# EAGLE design LEDDistortionV2 (EAGLE 6.5.0)
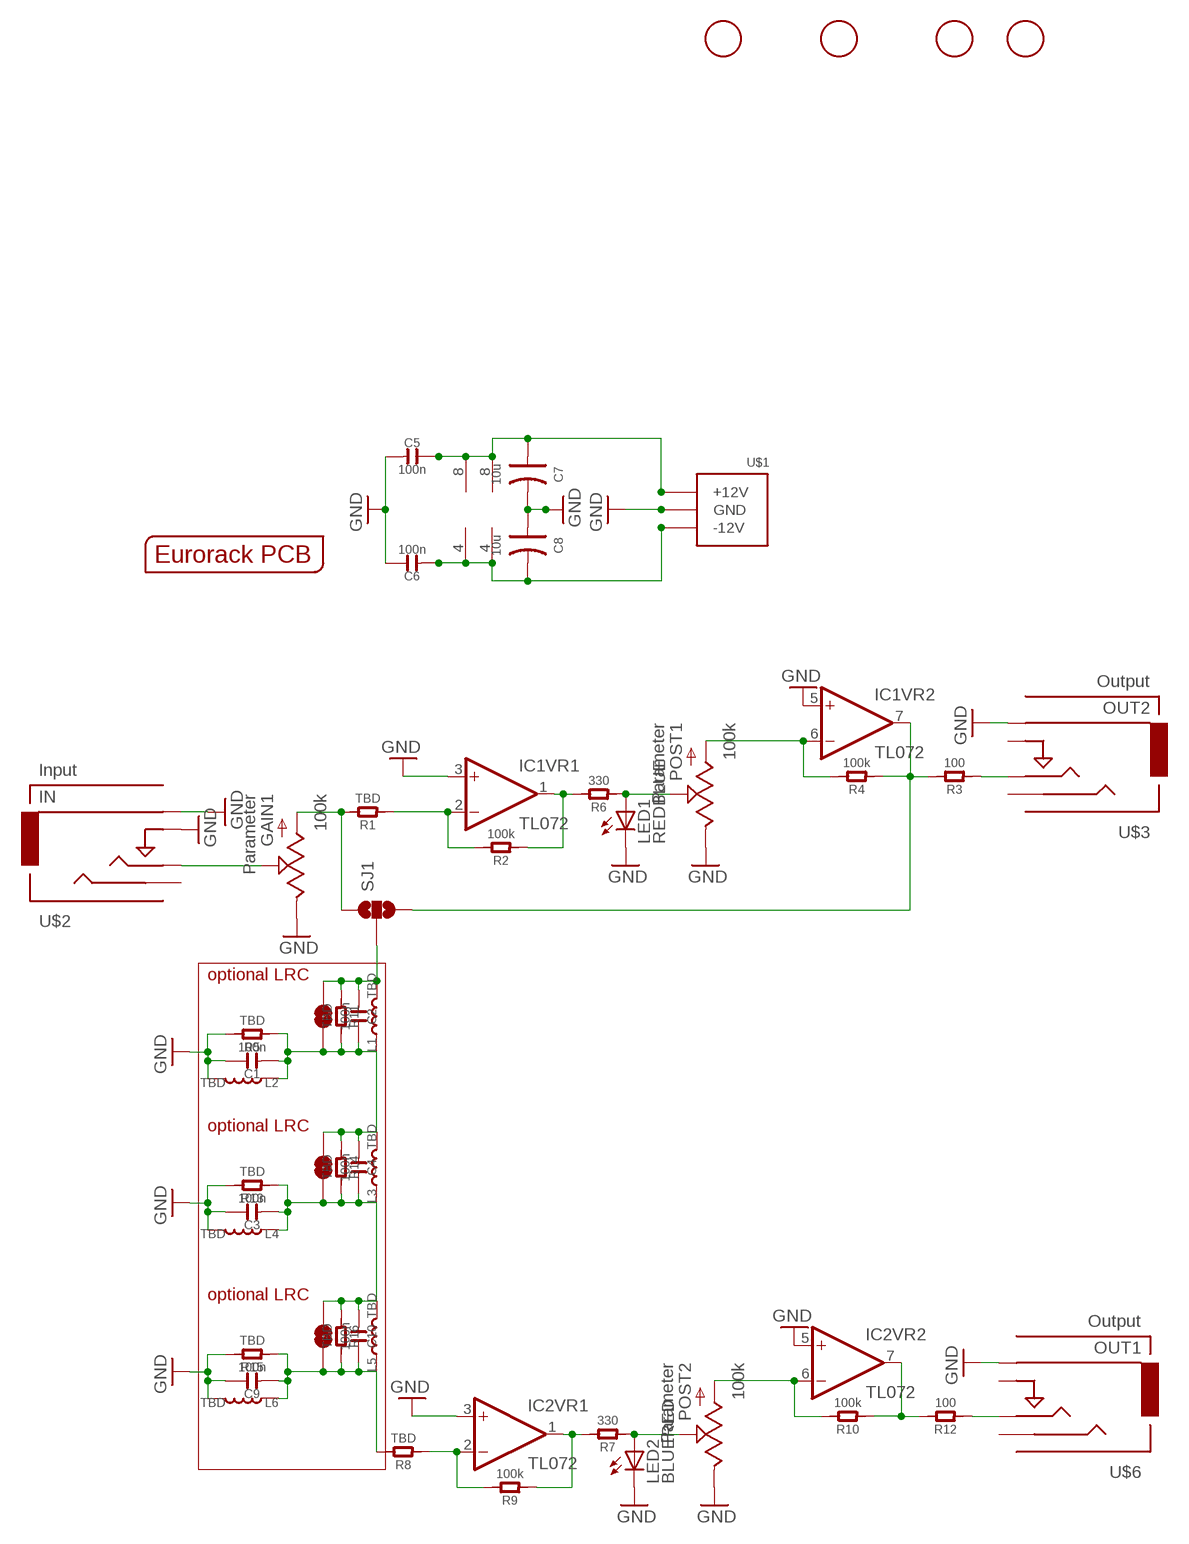
[diagram p0: schematic, sheet 1]

## Parts
C1  100n  C-0805  [C0805]
C2  100n  C-0805  [C0805]
C3  100n  C-0805  [C0805]
C4  100n  C-0805  [C0805]
C5  100n  C-0805  [C0805]
C6  100n  C-0805  [C0805]
C7  10u  C-POLAR-A  [AVX-A]
C8  10u  C-POLAR-A  [AVX-A]
C9  100n  C-0805  [C0805]
C10  100n  C-0805  [C0805]
GAIN1  100k  POTZEPHPOT  [OG-POTS_ALPS_POT_VERTICAL]
IC1  TL072  [SO08]
IC2  TL072  [SO08]
L1  TBD  L-SPD3D16-4R7M  [L0420]
L2  TBD  L-SPD3D16-4R7M  [L0420]
L3  TBD  L-SPD3D16-4R7M  [L0420]
L4  TBD  L-SPD3D16-4R7M  [L0420]
L5  TBD  L-SPD3D16-4R7M  [L0420]
L6  TBD  L-SPD3D16-4R7M  [L0420]
LED1  REDBLUE  LED3MM  [LED3MM]
LED2  BLUERED  LED3MM  [LED3MM]
POST1  100k  POTZEPHPOT  [OG-POTS_ALPS_POT_VERTICAL]
POST2  100k  POTZEPHPOT  [OG-POTS_ALPS_POT_VERTICAL]
R1  TBD  R  [C0805]
R2  100k  R  [C0805]
R3  100  R  [C0805]
R4  100k  R  [C0805]
R5  TBD  R  [C0805]
R6  330  R  [C0805]
R7  330  R  [C0805]
R8  TBD  R  [C0805]
R9  100k  R  [C0805]
R10  100k  R  [C0805]
R11  TBD  R  [C0805]
R12  100  R  [C0805]
R13  TBD  R  [C0805]
R14  TBD  R  [C0805]
R15  TBD  R  [C0805]
R16  TBD  R  [C0805]
SJ1  SOLDERJUMPER_2WAYPASTE1&2  [SJ_3_PASTE1&2]
SJ2  SOLDERJUMPERNC  [SJ_2S]
SJ3  SOLDERJUMPERNC  [SJ_2S]
SJ4  SOLDERJUMPERNC  [SJ_2S]
U$1  POWER_SIMPLE10  [POWER_10]
U$2  IN  AUDIO-JACKINPUT  [3.5MM-JACK-SWITCH-13MM-INPUT]
U$3  OUT2  AUDIO-JACKOUTPUT  [3.5MM-JACK-SWITCH-13MM-OUTPUT]
U$4  EURORACK_PCB4HP  [EURORACK4HPPCB]
U$5  FIDUCIAL  [FIDUCIAL_1MM]
U$6  OUT1  AUDIO-JACKOUTPUT  [3.5MM-JACK-SWITCH-13MM-OUTPUT]
U$7  FIDUCIAL  [FIDUCIAL_1MM]
U$8  FIDUCIAL  [FIDUCIAL_1MM]
U$9  FIDUCIAL  [FIDUCIAL_1MM]

## Nets
GND: C1.2 C3.2 C5.1 C6.2 C7.- C8.+ C9.2 GAIN1.P$1(E) IC1.3(VR1:+IN) IC1.5(VR2:+IN) IC2.3(VR1:+IN) IC2.5(VR2:+IN) L2.2 L4.2 L6.2 LED1.K(C) LED2.K(C) POST1.P$1(E) POST2.P$1(E) R5.2 R13.2 R15.2 U$1.3(GND) U$1.4(GND) U$1.5(GND) U$1.6(GND) U$1.7(GND) U$1.8(GND) U$2.RING@3(RING) U$2.SWITCH@3(SWITCH) U$3.RING@3(RING) U$6.RING@3(RING)
N$1: C2.1 L1.2 R11.1 SJ1.2 SJ2.2
N$2: LED1.A POST1.P$2(S) R6.1
N$3: GAIN1.P$3(A) R1.2 SJ1.1
N$4: IC1.6(VR2:-IN) POST1.P$3(A) R4.2
N$5: R3.1 U$3.TIP@3(TIP)
N$6: GAIN1.P$2(S) U$2.TIP@3(TIP)
N$7: LED2.A POST2.P$2(S) R7.1
N$10: IC2.6(VR2:-IN) POST2.P$3(A) R10.2
N$11: C1.1 C2.2 C4.1 L1.1 L2.1 L3.2 R5.1 R11.2 R14.1 SJ2.1 SJ3.2
N$12: R12.1 U$6.TIP@3(TIP)
N$13: C9.1 C10.2 L5.1 L6.1 R8.2 R15.1 R16.2 SJ4.1
N$14: C3.1 C4.2 C10.1 L3.1 L4.1 L5.2 R13.1 R14.2 R16.1 SJ3.1 SJ4.2
OP1NEG: IC1.2(VR1:-IN) R1.1 R2.2
OP1NEG1: IC2.2(VR1:-IN) R8.1 R9.2
OP1OUT: IC1.1(VR1:OUT) R2.1 R6.2
OP1OUT1: IC2.1(VR1:OUT) R7.2 R9.1
OP2OUT: IC1.7(VR2:OUT) R3.2 R4.1 SJ1.3
OP2OUT1: IC2.7(VR2:OUT) R10.1 R12.2
VNEG: C6.1 C8.- IC1.4(VR3:V-) IC2.4(VR3:V-) U$1.1(-12V) U$1.2(-12V)
VPOS: C5.2 C7.+ IC1.8(VR3:V+) IC2.8(VR3:V+) U$1.9(+12V) U$1.10(+12V)
Unconnected: U$2.SECOND@3(SECOND) U$3.SECOND@3(SECOND) U$3.SWITCH@3(SWITCH) U$6.SECOND@3(SECOND) U$6.SWITCH@3(SWITCH)

## Notes on the sheet
- optional LRC
- optional LRC
- optional LRC

## Library data of the parts
C1-C6 C9 C10 = OPL:C*
C7 C8 = OPL:C-POLAR*
GAIN1 POST1 POST2 = EurorackModularParts:POT; DESC: Parameter
IC1 IC2 = EurorackModularParts:TL072
L1-L6 = OPL:L*
LED1 LED2 = SparkFun-LED:LED: LEDs Standard schematic elements and footprints for 5mm, 3mm, 1206, and 0603 sized LEDs. 5mm - Spark Fun Electronics SKU : COM-00529 (and others)
R1-R16 = OPL:R*
SJ1 = SparkFun-Passives:SOLDERJUMPER_2WAY: Solder Jumper 2 way solder jumper
SJ2-SJ4 = SparkFun-Passives:SOLDERJUMPER: Solder Jumper Standard SMD solder jumper. Used to automate production. Two varients : Normally Open and Normally Closed are the same, but have different paste layers. NC will have a large amount of paste and should jumper during reflow.
U$1 = EurorackModularParts:POWER_SIMPLE
U$2 = EurorackModularParts:AUDIO-JACK: Switching Mono 3.5mm Audio Jack from Erthenvar.; DESC: Input; MPN: PJ-341; VALUE: PJ-341
U$3 U$6 = EurorackModularParts:AUDIO-JACK: Switching Mono 3.5mm Audio Jack from Erthenvar.; DESC: Output; MPN: PJ-341; VALUE: PJ-341
U$4 = EurorackModularParts:EURORACK_PCB
U$5 U$7-U$9 = adafruit:FIDUCIAL: For use by pick and place machines to calibrate the vision/machine, 1mm By microbuilder.eu

## Net classes
0 default: width 0.305 mm

## Board
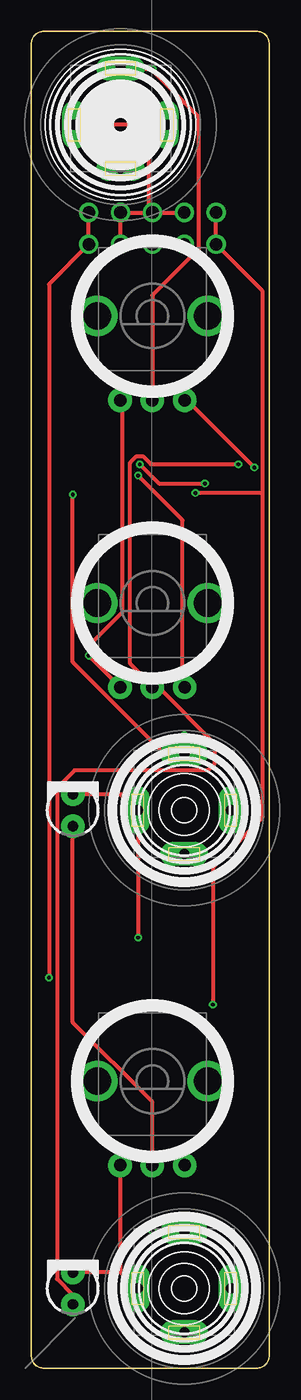
[diagram p1: board, top side]
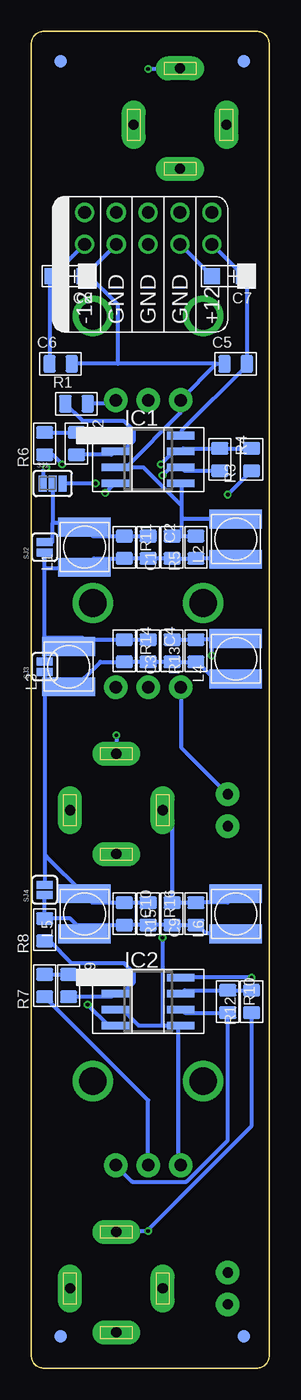
[diagram p2: board, bottom side, seen from below]

Size 18.98 x 106.5 mm. Coordinates in mm from the lower left corner, seen from the top.
Copper layers (1*16): Top 0.035mm / dielectric 1.5mm / Bottom 0.035mm
Design rules "ITEADstudio_DRC": minimum track width 6mil, minimum drill 12mil, track to track 6mil, track to pad 6mil, pad to pad 6mil, via to via 6mil, smd to smd 0mil, copper to edge 10mil, drill to drill 10mil, minimum pad ring 10mil, minimum via ring 6mil, stop-mask expansion 2mil, vias tented up to drill 100mil, thermal gap 10mil

### Footprints (pad centres in the part's own frame; a part is rotated, then mirrored left to right if it is on the bottom)
C0805 = smd 1.016 x 1.397: 1 -0.889,0; 2 0.889,0
AVX-A = smd 1.27 x 1.27: + -1.27,0; - 1.27,0
OG-POTS_ALPS_POT_VERTICAL = drill 1 pad 1.88: P$1 -2.58,-6.7; P$2 0,-6.7; P$3 2.58,-6.7 | drill 2.2 pad 3.175: P$4 4.4,0; P$5 -4.4,0
SO08 = smd 0.6 x 2.2: 1 -1.905,-2.6; 2 -0.635,-2.6; 3 0.635,-2.6; 4 1.905,-2.6; 5 1.905,2.6; 6 0.635,2.6; 7 -0.635,2.6; 8 -1.905,2.6
L0420 = smd 1.5 x 4.2: 1 -1.6,0; 2 1.6,0
LED3MM = drill 0.813 pad 1.88: A -1.27,0; K 1.27,0
SJ_3_PASTE1&2 = smd 0.635 x 1.27: 1 -0.813,0; 2 0,0; 3 0.813,0
SJ_2S = smd 0.635 x 1.27: 1 -0.412,0; 2 0.412,0
POWER_10 = drill 1.016: 1 -5.08,-1.27; 2 -5.08,1.27; 3 -2.54,-1.27; 4 -2.54,1.27; 5 0,-1.27; 6 0,1.27; 7 2.54,-1.27; 8 2.54,1.27; 9 5.08,-1.27; 10 5.08,1.27
3.5MM-JACK-SWITCH-13MM-INPUT = drill 0.8 pad 1.93 long: RING@3 -3.7,0; SECOND@3 0,-3.5; SWITCH@3 3.7,0; TIP@3 0,4.5
3.5MM-JACK-SWITCH-13MM-OUTPUT = drill 0.8 pad 1.93 long: RING@3 -3.7,0; SECOND@3 0,-3.5; SWITCH@3 3.7,0; TIP@3 0,4.5
FIDUCIAL_1MM = smd 1 x 1: 1 0,0

### Placement (x,y rotation side)
C1  7.76,65.41 90 bottom
C2  9.66,65.41 270 bottom
C3  7.76,57.15 90 bottom
C4  9.66,57.15 270 bottom
C5  2.67,80.01 0 bottom
C6  16.64,80.01 0 bottom
C7  3.31,87 180 bottom
C8  16.01,87 180 bottom
C9  5.85,36.2 90 bottom
C10  11.56,36.2 270 bottom
GAIN1  9.66,83.82 0 top
IC1  9.66,72.39 270 bottom
IC2  9.66,29.21 270 bottom
L1  14.74,65.41 90 bottom
L2  2.67,66.04 90 bottom
L3  16.01,55.88 90 bottom
L4  2.67,56.52 90 bottom
L5  14.74,36.2 90 bottom
L6  2.67,36.2 90 bottom
LED1  3.31,6.35 90 top
LED2  3.31,44.45 90 top
POST1  9.66,60.96 0 top
POST2  9.66,22.86 0 top
R1  15.38,76.83 0 bottom
R2  15.38,73.66 270 bottom
R3  1.41,72.39 90 bottom
R4  3.95,72.39 270 bottom
R5  5.85,65.41 90 bottom
R6  17.91,73.66 90 bottom
R7  17.91,30.48 90 bottom
R8  17.91,34.92 90 bottom
R9  16.01,30.48 270 bottom
R10  3.31,29.21 270 bottom
R11  11.56,65.41 270 bottom
R12  1.41,29.21 90 bottom
R13  5.85,57.15 90 bottom
R14  11.56,57.15 270 bottom
R15  7.76,36.2 90 bottom
R16  9.66,36.2 270 bottom
SJ1  17.28,70.48 0 bottom
SJ2  17.91,65.41 90 bottom
SJ3  17.91,55.88 90 bottom
SJ4  17.91,38.1 90 bottom
U$1  9.66,90.81 0 bottom
U$2  7.12,99.06 0 top
U$3  12.2,44.45 0 top
U$4  -0.5,0 0 top
U$5  16.64,2.54 0 bottom
U$6  12.2,6.35 0 top
U$7  2.04,2.54 0 bottom
U$8  16.64,104.14 0 bottom
U$9  2.04,104.14 0 bottom

### Tracks (layer width: path | path; a pad name or v marks a point on that pad's centre or on a via)
GND  (via drill 0.3)
  Top 0.305: 7.12,7.62 LED1.K | 7.12,7.62 8.39,6.35 U$6.RING@3 | 7.12,7.62 7.12,16.13 POST2.P$1 | LED2.K 7.12,45.72 8.39,44.45 U$3.RING@3 8.52,44.32 v8.52,34.29 | POST1.P$1 6.99,54.36 v4.58,56.77 4.58,57.53 7.25,60.2 7.25,76.96 7.12,77.09 GAIN1.P$1 | U$2.SWITCH@3 9.41,99.06 | 9.41,99.06 U$2.RING@3 | U$1.6 U$1.8 U$1.7 U$1.5 U$1.3 | U$1.6 U$1.4 | 9.41,99.06 9.41,92.2 U$1.6
  Bottom 0.305: 8.52,27.3 10.42,27.3 11.69,28.57 IC2.3 | 8.52,27.3 IC2.5 7.25,27.18 7.25,16.38 7.12,16.26 POST2.P$1 | C3.2 R13.2 2.67,58.04 L4.2 4.58,57.91 v4.58,56.77 | L6.2 2.67,37.72 3.31,37.08 C9.2 R15.2 7.76,43.81 8.39,44.45 U$3.RING@3 | LED2.K 6.99,49.4 6.99,54.23 POST1.P$1 | U$1.3 C8.+ 14.49,87.12 12.07,84.71 12.07,80.01 | U$1.7 C7.- | 4.2,80.01 C5.1 | 4.2,80.01 6.99,77.22 GAIN1.P$1 7.12,77.09 7.12,76.07 11.31,71.88 IC1.3 10.04,71.75 7.12,68.83 6.99,68.83 | 4.2,80.01 12.07,80.01 | 12.07,80.01 C6.2 | C1.2 6.99,66.29 | 6.99,66.29 R5.2 | 6.99,68.83 6.99,70.48 IC1.5 | 6.99,68.83 6.99,67.69 | 6.99,67.69 6.99,66.29 | 6.99,67.69 2.67,67.69 L2.2 | v8.52,34.29 8.52,27.3
N$1
  Bottom 0.305: SJ2.2 17.28,65.82 17.28,67.31 | 17.28,67.31 15.12,67.31 14.87,67.06 L1.2 14.74,66.93 14.11,66.29 R11.1 C2.1 | SJ1.2 17.28,67.31
N$2  (via drill 0.3)
  Top 0.305: v16.52,72.01 9.53,72.01 8.9,72.64 8.39,72.64 7.88,72.14 7.88,56.13 9.66,54.36 POST1.P$2 9.79,54.23 10.17,54.23 14.61,49.78 14.61,48.13 14.11,47.62 3.44,47.62 2.04,46.23 2.04,7.11 3.31,5.84 LED1.A
  Bottom 0.305: R6.1 17.28,72.77 v16.52,72.01
N$3  (via drill 0.3)
  Top 0.305: v17.79,71.75 12.33,77.22 GAIN1.P$3
  Bottom 0.305: v17.79,71.75 18.04,71.5 18.04,70.48 SJ1.1 | R1.2 12.58,76.83 12.33,77.09 GAIN1.P$3
N$4  (via drill 0.3)
  Top 0.305: v8.52,71.12 12.07,67.56 12.07,54.48 12.2,54.36 POST1.P$3
  Bottom 0.305: R4.2 6.74,71.5 6.99,71.75 IC1.6 7.12,71.63 8.01,71.63 v8.52,71.12
N$5  (via drill 0.3)
  Top 0.305: v3.31,69.6 3.31,56.26 10.55,49.02 12.2,49.02 U$3.TIP@3 v12.2,50.42
  Bottom 0.305: v3.31,69.6 R3.1 | v12.2,50.42 U$3.TIP@3
N$6  (via drill 0.3)
  Top 0.305: GAIN1.P$2 9.66,85.47 13.34,89.15 13.34,99.69 9.6,103.44 | 9.6,103.44 9.53,103.5 7.12,103.5 U$2.TIP@3 | v9.66,103.5 9.6,103.44
  Bottom 0.305: v9.66,103.5 7.12,103.5 U$2.TIP@3
N$7
  Top 0.305: LED2.A 3.31,27.56 9.66,21.21 POST2.P$2
  Bottom 0.305: R7.1 9.66,21.34 POST2.P$2
N$10
  Bottom 0.305: IC2.6 6.99,28.57 6.74,28.32 R10.2 3.31,18.16 6.61,14.86 10.93,14.86 12.2,16.13 POST2.P$3
N$11
  Bottom 0.305: SJ3.2 17.91,58.17 | 17.91,58.17 17.91,63.75 | 17.91,63.75 SJ2.1 | L2.1 2.67,64.52 R5.1 C1.1 C2.2 R11.2 13.98,64.52 14.61,63.88 L1.1 14.74,63.75 17.91,63.75 | C4.1 R14.1 14.74,58.04 L3.2 14.87,58.17 17.91,58.17
N$12  (via drill 0.3)
  Top 0.305: v9.66,10.92 12.2,10.92 U$6.TIP@3
  Bottom 0.305: R12.1 1.41,19.3 9.72,10.99 | 9.72,10.99 9.79,10.92 12.2,10.92 U$6.TIP@3 | v9.66,10.92 9.72,10.99
N$13
  Bottom 0.305: SJ4.1 R8.2 15.88,35.81 14.74,34.67 L5.1 15.25,35.31 C10.2 R16.2 R15.1 C9.1 5.72,35.31 5.09,34.67 2.67,34.67 L6.1
N$14
  Bottom 0.305: SJ3.1 17.91,54.86 | 17.91,54.86 17.91,40.77 | 17.91,40.77 SJ4.2 | R16.1 C10.1 14.11,37.08 14.74,37.72 L5.2 14.87,37.85 17.79,40.77 17.91,40.77 | L4.1 2.67,54.99 4.45,54.99 5.72,56.26 R13.1 C3.1 C4.2 R14.2 13.47,56.26 14.74,54.99 L3.1 14.87,54.86 17.91,54.86
OP1NEG
  Bottom 0.305: R2.2 12.58,72.77 12.33,73.03 IC1.2 12.2,73.15 11.56,73.15 10.8,73.91 10.8,74.68 11.56,75.44 14.87,75.44 R1.1
OP1NEG1
  Bottom 0.305: R9.2 12.58,29.59 12.33,29.84 IC2.2 12.2,29.97 11.56,29.97 10.8,30.73 10.8,31.5 11.56,32.26 15.76,32.26 17.53,34.04 R8.1
OP1OUT
  Bottom 0.305: R6.2 R2.1 15.25,74.55 14.99,74.3 IC1.1
OP1OUT1
  Bottom 0.305: R7.2 R9.1 12.58,31.37 12.33,31.11 IC2.1
OP2OUT  (via drill 0.3)
  Top 0.305: v13.85,70.48 10.17,70.48 v8.64,72.01
  Bottom 0.305: R3.2 R4.1 6.87,73.28 6.99,73.15 IC1.7 7.63,73.03 v8.64,72.01 | v13.85,70.48 SJ1.3
OP2OUT1
  Bottom 0.305: R12.2 R10.1 6.74,30.1 6.99,29.84 IC2.7
VNEG  (via drill 0.3)
  Top 0.305: v14.49,28.96 14.49,39.88 18.42,43.81 18.42,69.72 | 18.42,69.72 18.42,85.85 U$1.1 U$1.2 | 18.42,69.72 v13.09,69.72
  Bottom 0.305: U$1.1 C8.- 17.28,86.87 17.53,86.61 C6.1 | IC2.4 12.84,27.3 v14.49,28.96 | v13.09,69.72 12.33,70.48 IC1.4
VPOS  (via drill 0.3)
  Top 0.305: v1.41,31.11 1.41,86.36 U$1.9 U$1.10
  Bottom 0.305: U$1.9 C7.+ 2.04,86.87 1.79,86.61 C5.2 1.79,79.88 6.99,74.68 6.99,74.3 IC1.8 | v1.41,31.11 IC2.8